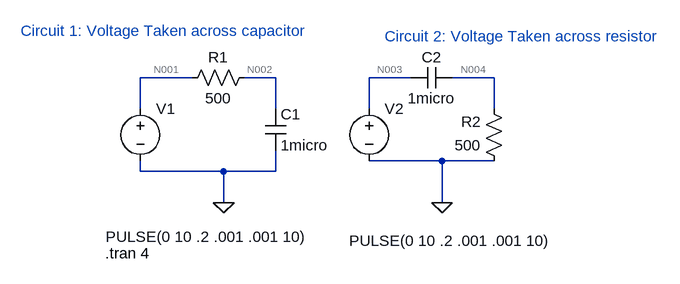
[diagram p0: schematic 1_RC_and_CR_Circuit.asc]
1_RC_and_CR_Circuit.asc, the LTspice schematic file:
Version 4
SHEET 1 880 680
WIRE 64 64 -16 64
WIRE 192 64 144 64
WIRE 400 64 336 64
WIRE 528 64 464 64
WIRE -16 112 -16 64
WIRE 192 112 192 64
WIRE 336 112 336 64
WIRE 528 112 528 64
WIRE 448 192 336 192
WIRE 528 192 448 192
WIRE -16 208 -16 192
WIRE 112 208 -16 208
WIRE 192 208 192 176
WIRE 192 208 112 208
WIRE 112 256 112 208
WIRE 448 256 448 192
FLAG 112 256 0
FLAG 448 256 0
SYMBOL voltage -16 96 R0
WINDOW 3 -53 213 Left 2
WINDOW 123 0 0 Left 0
WINDOW 39 0 0 Left 0
SYMATTR InstName V1
SYMATTR Value PULSE(0 10 .2 .001 .001 10)
SYMBOL voltage 336 96 R0
WINDOW 3 -31 219 Left 2
WINDOW 123 0 0 Left 0
WINDOW 39 0 0 Left 0
SYMATTR InstName V2
SYMATTR Value PULSE(0 10 .2 .001 .001 10)
SYMBOL res 160 48 R90
WINDOW 0 0 56 VBottom 2
WINDOW 3 32 56 VTop 2
SYMATTR InstName R1
SYMATTR Value 500
SYMBOL res 544 208 R180
WINDOW 0 36 76 Left 2
WINDOW 3 36 40 Left 2
SYMATTR InstName R2
SYMATTR Value 500
SYMBOL cap 176 112 R0
SYMATTR InstName C1
SYMATTR Value 1micro
SYMBOL cap 464 48 R90
WINDOW 0 0 32 VBottom 2
WINDOW 3 32 32 VTop 2
SYMATTR InstName C2
SYMATTR Value 1micro
TEXT -70 334 Left 2 !.tran 4
TEXT -200 -8 Left 2 ;Circuit 1: Voltage Taken across capacitor
TEXT 360 0 Left 2 ;Circuit 2: Voltage Taken across resistor

The netlist it stands for:
* 1_RC_and_CR_Circuit.asc
V1 N001 0 PULSE(0 10 .2 .001 .001 10)
V2 N003 0 PULSE(0 10 .2 .001 .001 10)
R1 N002 N001 500
R2 0 N004 500
C1 N002 0 1micro
C2 N004 N003 1micro
.tran 4
* Circuit 1: Voltage Taken across capacitor
* Circuit 2: Voltage Taken across resistor
.backanno
.end

* Results of the author's LTspice run, read from the files saved beside the schematic
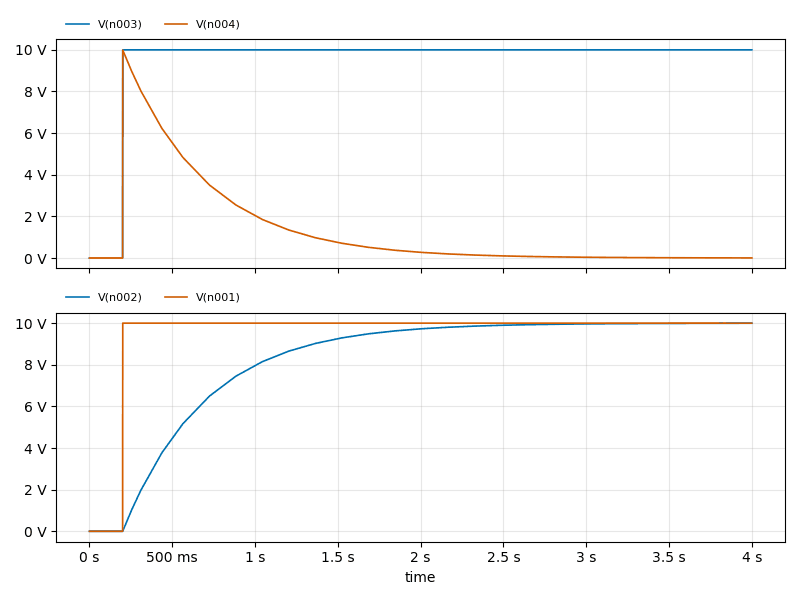
[diagram p1: Transient Analysis of 1_RC_and_CR_Circuit.asc, plotted from the saved traces]
* Transient Analysis, 1 run:
*   V(n003): min 0 V, max 10 V, average 9.499 V, rms 9.746 V, last 10 V
*   V(n004): min 0 V, max 9.99 V, average 1.257 V, rms 2.522 V, last 5.009 mV
*   V(n002): min 0 V, max 9.995 V, average 8.242 V, rms 8.73 V, last 9.995 V
*   V(n001): min 0 V, max 10 V, average 9.499 V, rms 9.746 V, last 10 V